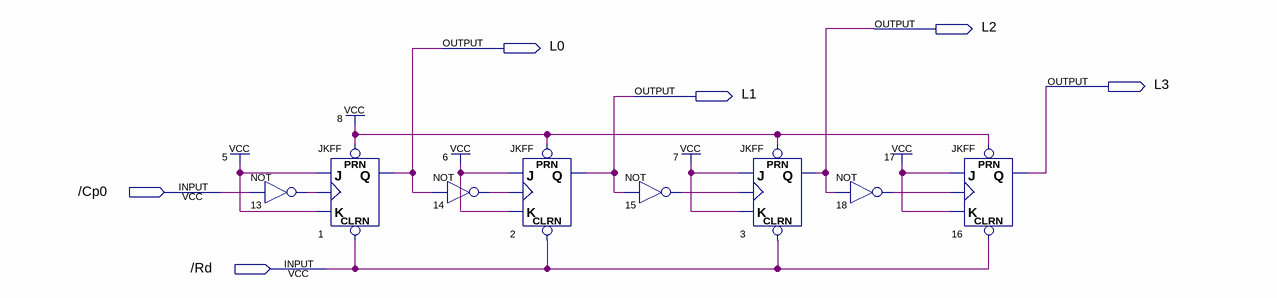
[diagram p0: schematic sheet]
// Quartus schematic fig12-13.bdf as structural Verilog: 8 symbols, 6 pins
module \fig12-13  (
  input  \/Cp0 ,
  input  \/Rd ,
  output L2,
  output L0,
  output L3,
  output L1
);

  wire n13_out, n14_out, n15_out, n18_out;

  not u_13 (n13_out, \/Cp0 );
  JKFF u_1 (.PRN(1'b1), .CLRN(\/Rd ), .K(1'b1), .J(1'b1), .CLK(n13_out), .Q(L0));
  not u_14 (n14_out, L0);
  JKFF u_2 (.PRN(1'b1), .CLRN(\/Rd ), .K(1'b1), .J(1'b1), .CLK(n14_out), .Q(L1));
  not u_15 (n15_out, L1);
  JKFF u_3 (.PRN(1'b1), .CLRN(\/Rd ), .K(1'b1), .J(1'b1), .CLK(n15_out), .Q(L2));
  not u_18 (n18_out, L2);
  JKFF u_16 (.PRN(1'b1), .CLRN(\/Rd ), .K(1'b1), .J(1'b1), .CLK(n18_out), .Q(L3));
endmodule
